# EasyEDA Pro project HNDX.eprj, schematic Schematic7
Board Name: CAN-TTL; Create Date: 2025-07-09; Page Name: P1; Project Name: GP; Schematic Name: Schematic7; Update Date: 2025-07-09; Company: 嘉立创EDA; Page Size: A4; Version: V1.0
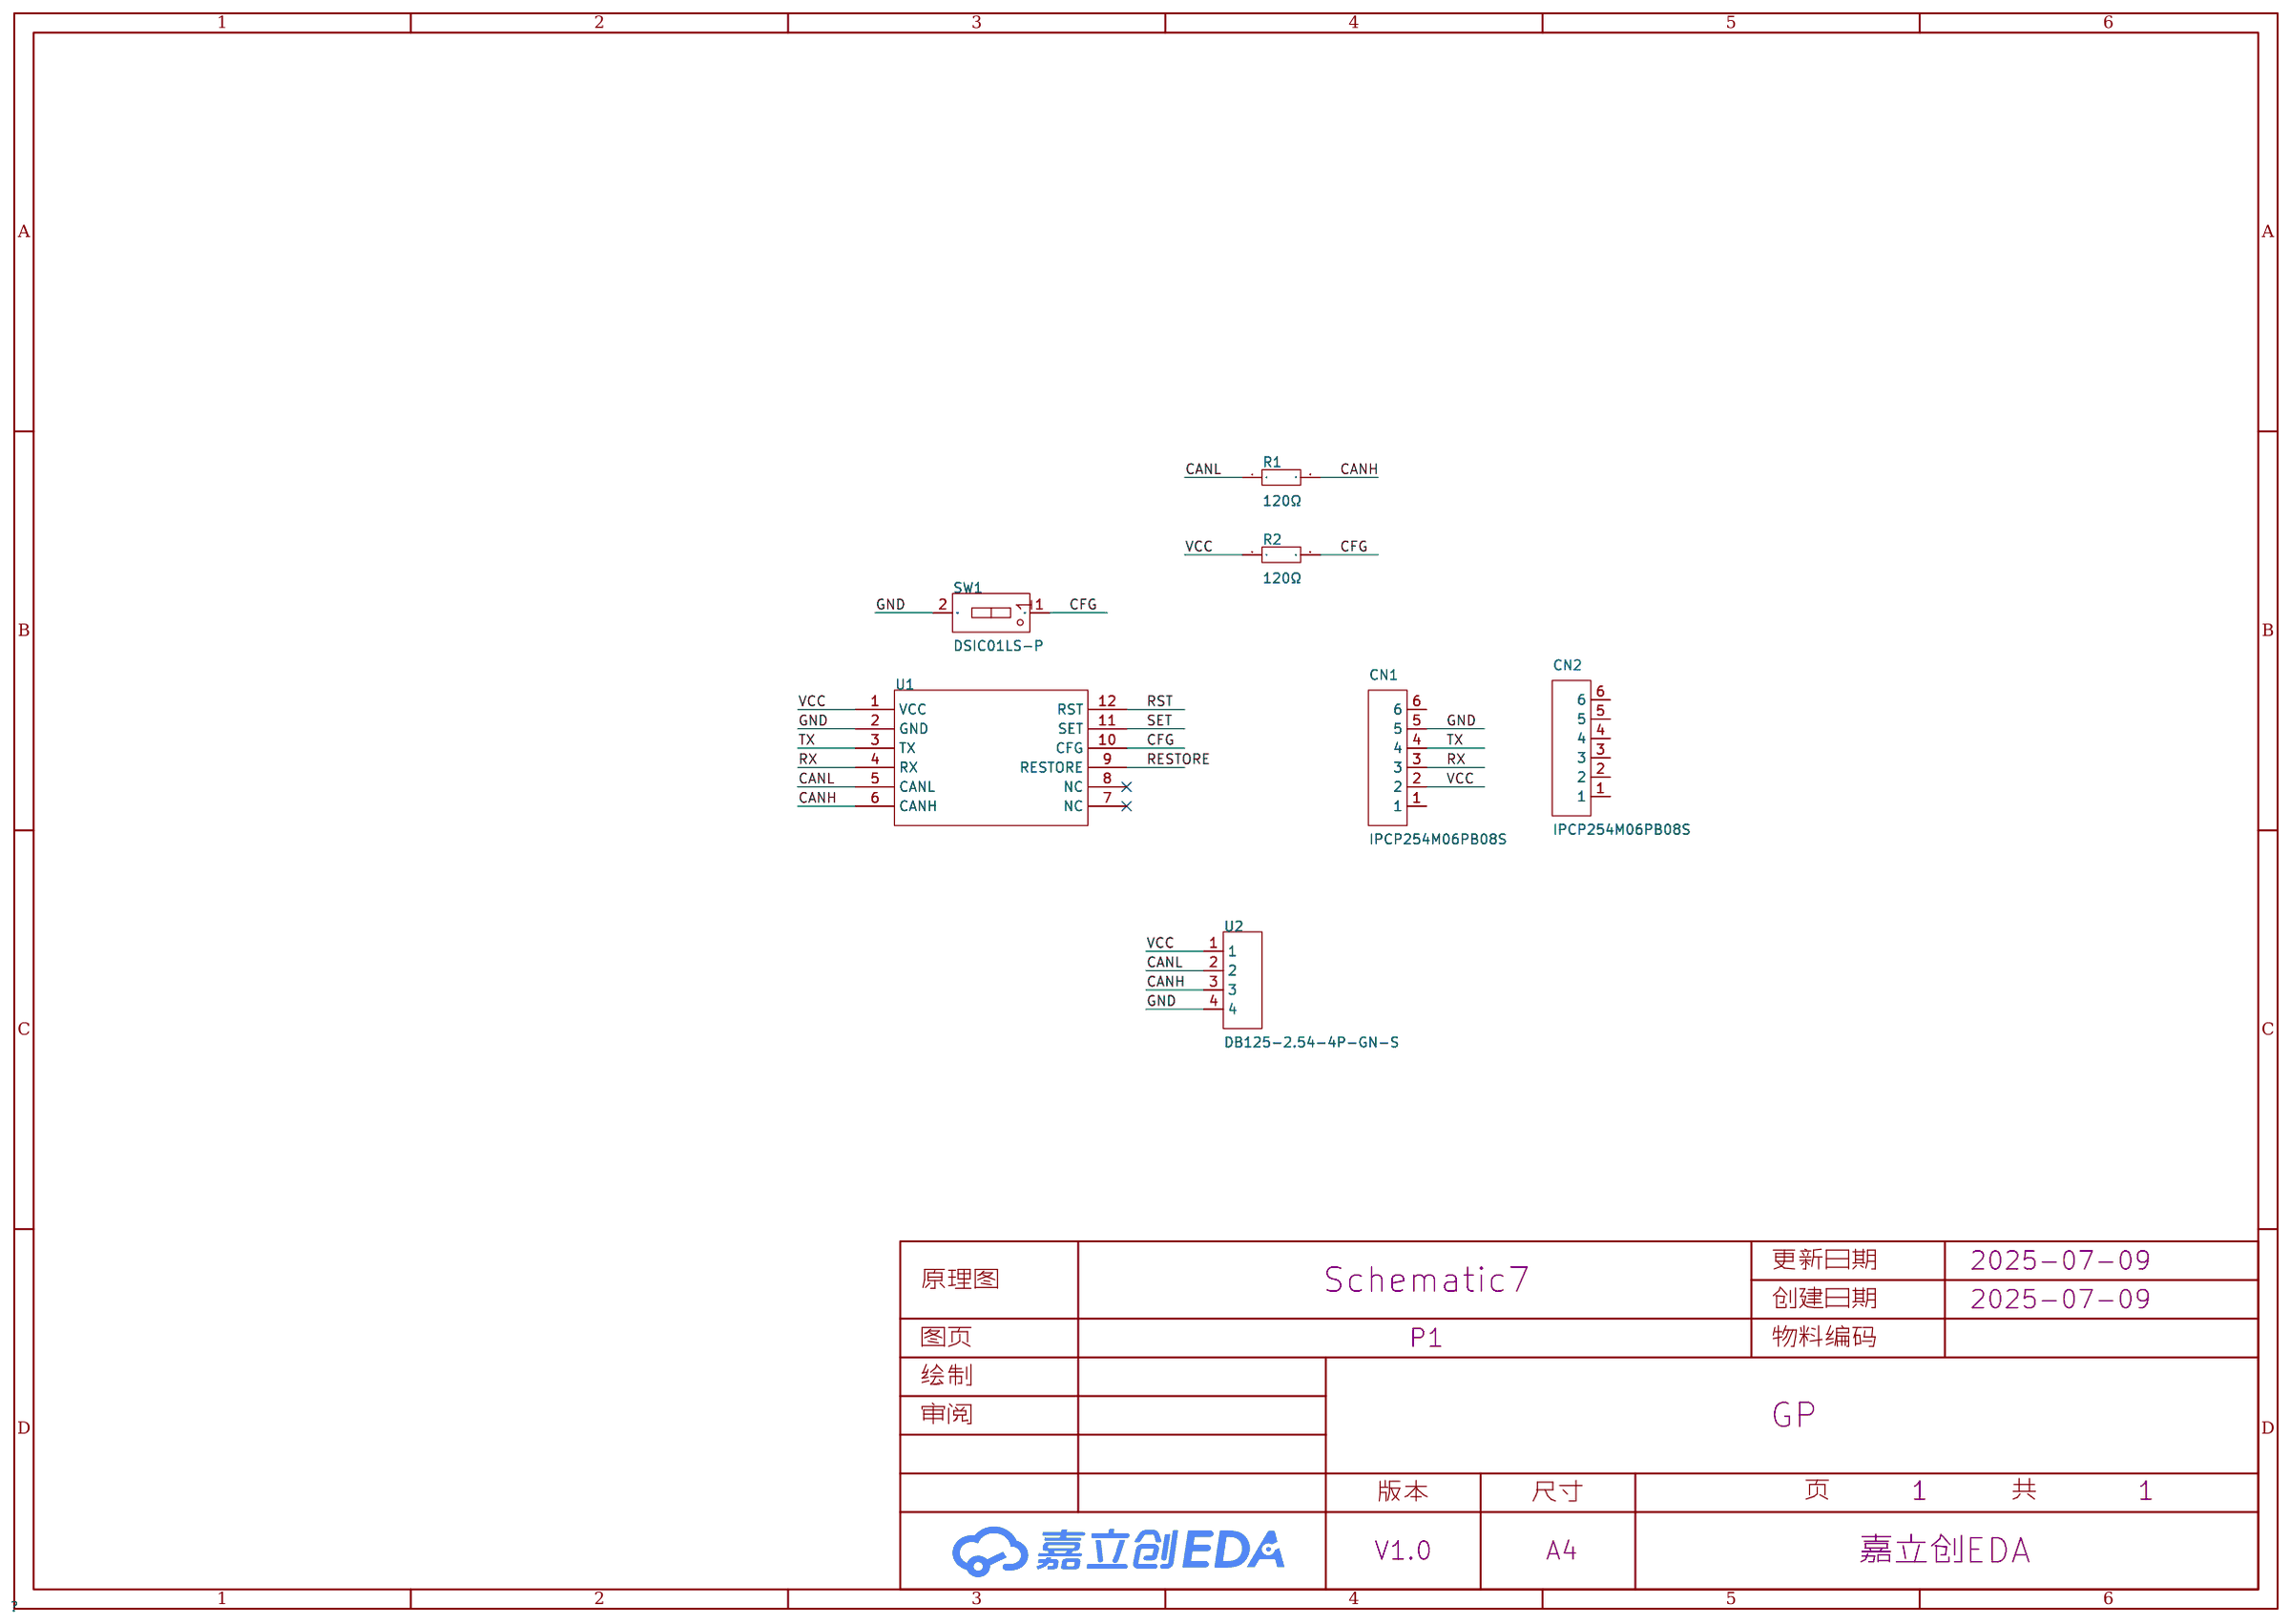
[diagram p8: schematic sheet]

## Parts
CN1  IPCP254M06PB08S  [HDR-SMD_6P-P2.54-V-M-S4.8]
CN2  IPCP254M06PB08S  [HDR-SMD_6P-P2.54-V-M-S4.8]
R1  120Ω  [R0603]
R2  120Ω  [R0603]
SW1  DSIC01LS-P  [SW-SMD_2P-L3.5-W6.2-P2.54-LS9.8]
U1  -  [CAN-ttl]
U2  DB125-2.54-4P-GN-S  [CONN-TH_DB125-2.54-4P-GN]

## Library data of the parts
CN1 CN2 = IPCP254M06PB08S: LCSC Part Name: 1x6P 间距:2.54mm 方针 立贴; Supplier Part: C22438430; Manufacturer: INCP; Supplier Footprint: SMD,P=2.54mm(交错脚); JLCPCB Part Class: 扩展库; Datasheet: https://atta.szlcsc.com/upload/public/pdf/source/20240523/B4FE6A2C412EE3021DC2B129EE5E4118.pdf; Supplier: LCSC; Pin Structure: 1x6P; Pitch: 2.54mm; Circluar Pins/Square Pins: 方针; Mounting Type: 立贴; Number of Rows: 单排; Number of Pins: 6P; Current Rating: 3A; Insulation Height: 2.5mm; Contact Material: 黄铜; Contact Plating: 金; Operating Temperature: -40℃~+105℃; Color: 黑色
R1 R2 = 0603WAF1200T5E: LCSC Part Name: 120Ω ±1% 100mW 厚膜电阻; Supplier Part: C22787; Manufacturer: UNI-ROYAL(厚声); Supplier Footprint: 0603; JLCPCB Part Class: 基础库; Datasheet: https://atta.szlcsc.com/upload/public/pdf/source/20200306/C422600_1E6D84923E4A46A82E41ADD87F860B5C.pdf; Supplier: LCSC; Type: 厚膜电阻; Tolerance: ±1%; Power(Watts): 100mW; Overload Voltage (Max): 75V; Temperature Coefficient: ±100ppm/℃; Operating Temperature Range: -55℃~+155℃
SW1 = DSIC01LS-P: LCSC Part Name: 平拨,凸起式 1位拨码开关; Supplier Part: C600988; Manufacturer: XKB Connectivity(中国星坤); Supplier Footprint: SMD,3.5x6.2mm; JLCPCB Part Class: 扩展库; Datasheet: https://atta.szlcsc.com/upload/public/pdf/source/20181029/C319044_89B44386426E378AA9595AB22F0589AA.pdf; Supplier: LCSC; Type: 平拨,凸起式; Circuit: 单刀单掷; Number of Positions: 1位; Pin Style: 鸥翼型; Current Rating: 25mA; Voltage Rating: 24V; Operating Temperature: -20℃~+70℃; Operating Life: 3千次; Color: 黑色
U1 = CAN-TTL
U2 = DB125-2.54-4P-GN-S: LCSC Part Name: 1x4P 2.54mm 直插 排数:1 每排P数:4; Supplier Part: C918122; Manufacturer: DORABO(地博电气); Supplier Footprint: 插件,P=2.54mm; JLCPCB Part Class: 扩展库; Datasheet: https://atta.szlcsc.com/upload/public/pdf/source/20230106/BCD3A0BE1EB95DC3E813F1745F022035.pdf; Supplier: LCSC; Number of Positions or Pins: 1x4P; Pitch: 2.54mm; Color: 绿色; Mounting Type: 直插; Number of Pins: 4P; Number of Rows: 1; Number of PINs Per Row: 4; Current Rating: 7A; Voltage Rating (Max): 150V; Wire Gauge - AWG: 18~26; Wire Gauge - mm2: 1; Operating Temperature: -40℃~+105℃

## Nets
GND: CN1.5 SW1.2(PIN2) U1.2(GND) U2.4
VCC: CN1.2 R2.1 U1.1(VCC) U2.1
CANH: R1.2 U1.6(CANH) U2.3
CANL: R1.1 U1.5(CANL) U2.2
CFG: R2.2 SW1.1(PIN1) U1.10(CFG)
RESTORE: U1.9(RESTORE)
RST: U1.12(RST)
RX: CN1.3 U1.4(RX)
SET: U1.11(SET)
TX: CN1.4 U1.3(TX)

Not connected (* = marked no-connect by the designer): CN1 1 6; CN2 1 2 3 4 5 6; U1 7(NC)* 8(NC)*
